# EAGLE design CD Memory New (EAGLE 7.7.0)
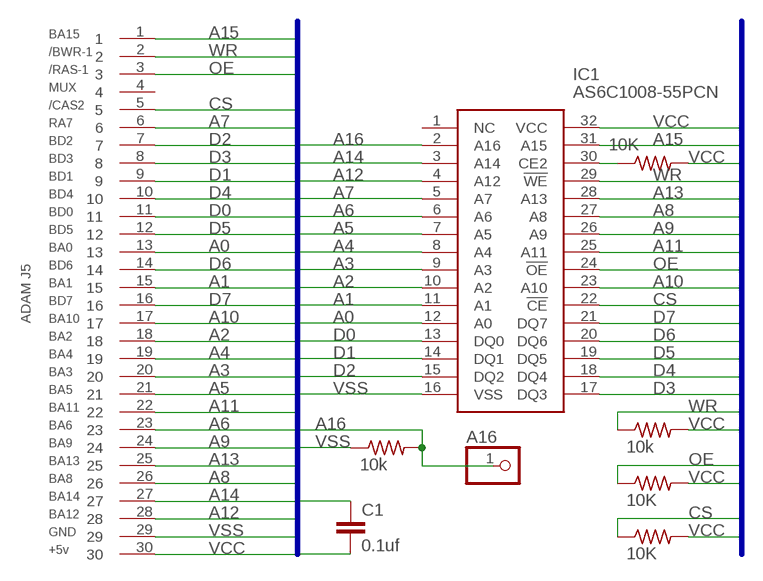
[diagram p0: schematic, sheet 1]

## Parts
A16  PINHD-1X1  [1X01]
C1  0.1uf  C-EU050-030X075  [C050-030X075]
IC1  AS6C1008-55PCN  [DIP254P1524X393-32]
R1  10K  R-US_V526-0  [V526-0]
R2  10k  R-US_V526-0  [V526-0]
R3  10K  R-US_V526-0  [V526-0]
R4  10K  R-US_V526-0  [V526-0]
R5  10k  R-US_V526-0  [V526-0]
U$1  MEM_CARD_NO_OUTLINE  [J5CARD_NO_OUTLINE]

## Nets
A0: IC1.12(A0) U$1.13
A1: IC1.11(A1) U$1.15
A2: IC1.10(A2) U$1.18
A3: IC1.9(A3) U$1.20
A4: IC1.8(A4) U$1.19
A5: IC1.7(A5) U$1.21
A6: IC1.6(A6) U$1.23
A7: IC1.5(A7) U$1.6
A8: IC1.27(A8) U$1.26
A9: IC1.26(A9) U$1.24
A10: IC1.23(A10) U$1.17
A11: IC1.25(A11) U$1.22
A12: IC1.4(A12) U$1.28
A13: IC1.28(A13) U$1.25
A14: IC1.3(A14) U$1.27
A15: IC1.31(A15) U$1.1
A16: A16.1 IC1.2(A16) R5.2
CS: IC1.22(!CE) R4.1 U$1.5
D0: IC1.13(DQ0) U$1.11
D1: IC1.14(DQ1) U$1.9
D2: IC1.15(DQ2) U$1.7
D3: IC1.17(DQ3) U$1.8
D4: IC1.18(DQ4) U$1.10
D5: IC1.19(DQ5) U$1.12
D6: IC1.20(DQ6) U$1.14
D7: IC1.21(DQ7) U$1.16
N$1: IC1.30(CE2) R1.1
OE: IC1.24(!OE) R3.1 U$1.3
VCC: C1.2 IC1.32(VCC) R1.2 R2.2 R3.2 R4.2 U$1.30
VSS: C1.1 IC1.16(VSS) R5.1 U$1.29
WR: IC1.29(!WE) R2.1 U$1.2
Unconnected: IC1.1(NC) U$1.4

## Buses
VSS,VCC,A[0..16],D[0..7],CS,OE,WR

## Library data of the parts
A16 = pinhead:PINHD-1X1: PIN HEADER
C1 = rcl:C-EU: CAPACITOR, European symbol
IC1 = SamacSys_Parts:AS6C1008-55PCN: CMOS SRAM Source: Datasheet <http://componentsearchengine.com/Datasheets/1/AS6C1008-55PCN.pdf>; DESCRIPTION: CMOS SRAM; HEIGHT: mm; MANUFACTURER_NAME: Alliance Memory; MANUFACTURER_PART_NUMBER: AS6C1008-55PCN; MOUSER_PART_NUMBER: 913-AS6C1008-55PCN; MOUSER_PRICE-STOCK: https://www.mouser.co.uk/ProductDetail/Alliance-Memory/AS6C1008-55PCN?qs=E5c5%252Bmu3i39qb4Qta5D2qg%3D%3D
R1-R5 = rcl:R-US_: RESISTOR, American symbol
U$1 = ADAM:MEM_CARD_NO_OUTLINE

## Board
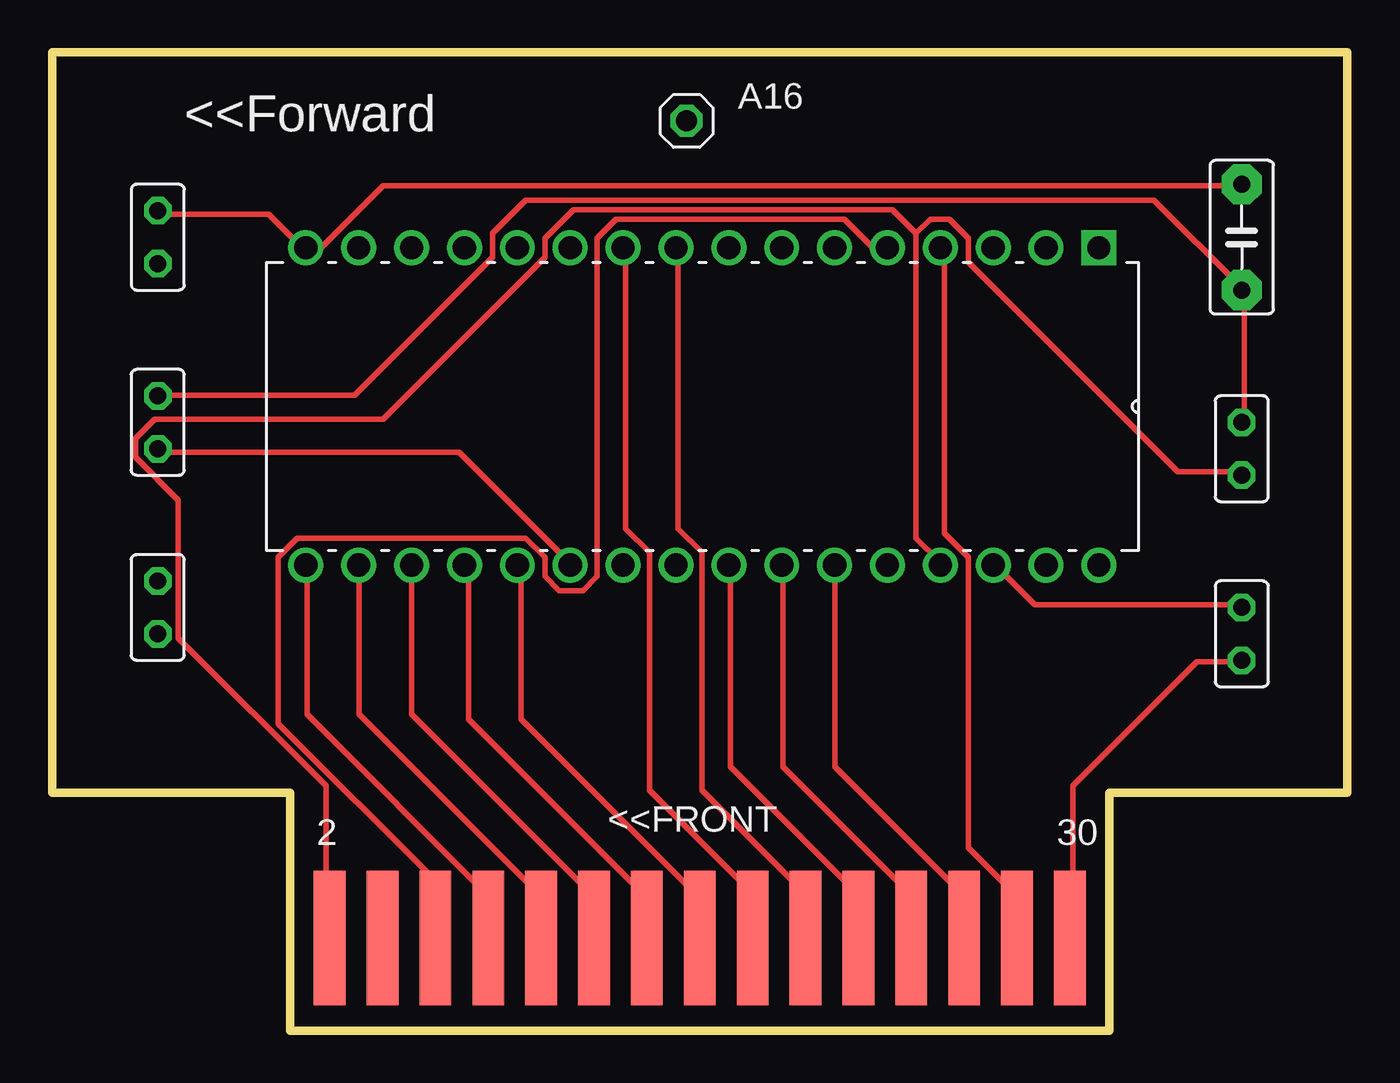
[diagram p1: board, top side]
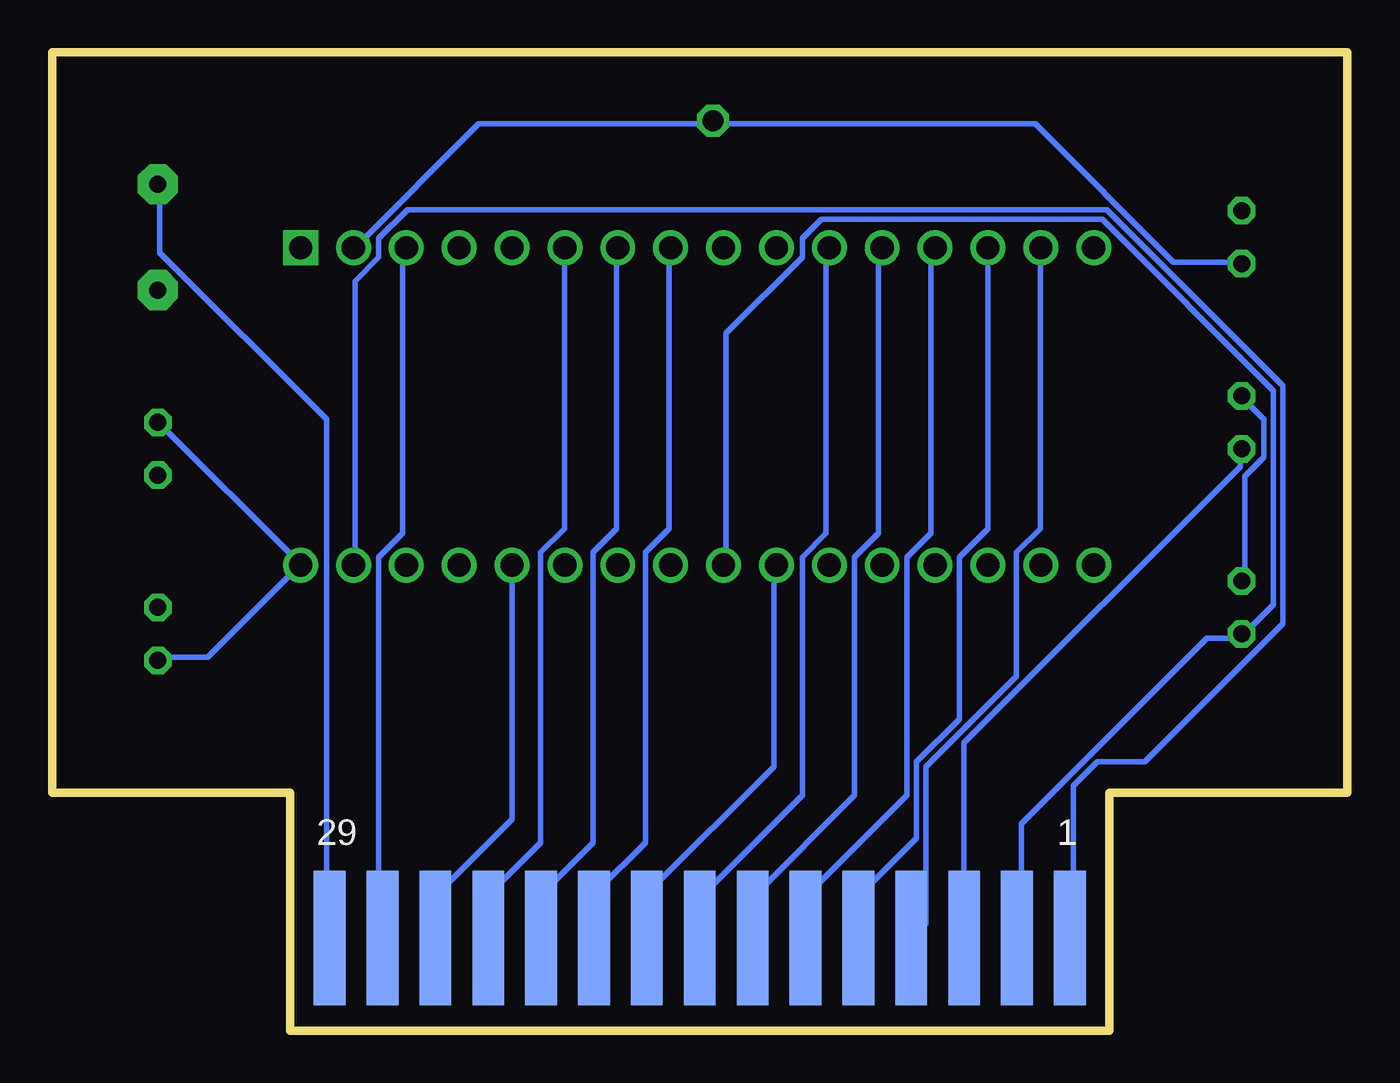
[diagram p2: board, bottom side, seen from below]

Size 62.23 x 46.99 mm. Coordinates in mm from the lower left corner, seen from the top.
Outline: 11.43,11.43 0,11.43 0,46.99 62.23,46.99 62.23,11.43 50.8,11.43 50.8,0 11.43,0 11.43,11.43
Copper layers (1*16): Top 0.035mm / dielectric 1.5mm / Bottom 0.035mm
Design rules "default": minimum track width 10mil, minimum drill 24mil, track to track 8mil, track to pad 8mil, pad to pad 8mil, via to via 8mil, smd to smd 8mil, copper to edge 40mil, drill to drill 8mil, minimum pad ring 10mil, minimum via ring 8mil, stop-mask expansion 4mil, vias tented up to drill 0mil, thermal gap 10mil

### Footprints (pad centres in the part's own frame; a part is rotated, then mirrored left to right if it is on the bottom)
1X01 = drill 1.016 octagon: 1 0,0
C050-030X075 = drill 0.813 pad 1.93 octagon: 1 -2.54,0; 2 2.54,0
DIP254P1524X393-32 = drill 1.118 pad 1.676 square: 1 -15.24,38.1 | drill 1.118 pad 1.676: 2 -15.24,35.56; 3 -15.24,33.02; 4 -15.24,30.48; 5 -15.24,27.94; 6 -15.24,25.4; 7 -15.24,22.86; 8 -15.24,20.32; 9 -15.24,17.78; 10 -15.24,15.24; 11 -15.24,12.7; 12 -15.24,10.16; 13 -15.24,7.62; 14 -15.24,5.08; 15 -15.24,2.54; 16 -15.24,0; 17 0,0; 18 0,2.54; 19 0,5.08; 20 0,7.62; 21 0,10.16; 22 0,12.7; 23 0,15.24; 24 0,17.78; 25 0,20.32; 26 0,22.86; 27 0,25.4; 28 0,27.94; 29 0,30.48; 30 0,33.02; 31 0,35.56; 32 0,38.1
V526-0 = drill 0.813 octagon: 1 -1.27,0; 2 1.27,0
J5CARD_NO_OUTLINE = smd 1.524 x 6.477 bottom: 1 -18.415,-5.715; 3 -15.875,-5.715; 5 -13.335,-5.715; 7 -10.795,-5.715; 9 -8.255,-5.715; 11 -5.715,-5.715; 13 -3.175,-5.715; 15 -0.635,-5.715; 17 1.905,-5.715; 19 4.445,-5.715; 21 6.985,-5.715; 23 9.525,-5.715; 25 12.065,-5.715; 27 14.605,-5.715; 29 17.145,-5.715 | smd 1.524 x 6.477: 2 -18.415,-5.715; 4 -15.875,-5.715; 6 -13.335,-5.715; 8 -10.795,-5.715; 10 -8.255,-5.715; 12 -5.715,-5.715; 14 -3.175,-5.715; 16 -0.635,-5.715; 18 1.905,-5.715; 20 4.445,-5.715; 22 6.985,-5.715; 24 9.525,-5.715; 26 12.065,-5.715; 28 14.605,-5.715; 30 17.145,-5.715

### Placement (x,y rotation side)
A16  30.48,43.69 0 top
C1  57.15,38.1 270 top
IC1  12.19,22.35 270 top
R1  57.15,19.05 270 top
R2  57.15,27.94 90 top
R3  5.08,20.32 90 top
R4  5.08,29.21 90 top
R5  5.08,38.1 270 top
U$1  31.75,10.16 0 top

### Tracks (layer width: path | path; a pad name or v marks a point on that pad's centre or on a via)
A0
  Bottom 0.254: IC1.12 22.53,37.59 22.53,23.88 23.67,22.73 23.67,11.3 28.47,6.5 28.47,4.45 U$1.13
A1
  Bottom 0.254: IC1.11 25.04,37.59 25.04,23.88 26.19,22.73 26.19,11.3 30.99,6.5 30.99,4.45 U$1.15
A2
  Top 0.254: IC1.10 27.56,37.59 27.56,24.11 28.7,22.96 28.7,11.53 33.5,6.73 33.5,4.45 U$1.18
A3
  Top 0.254: IC1.9 30.07,37.59 30.07,24.11 31.22,22.96 31.22,11.53 36.02,6.73 36.02,4.45 U$1.20
A4
  Bottom 0.254: IC1.8 32.59,37.59 32.59,24.11 33.73,22.96 33.73,9.02 36.02,6.73 36.02,4.45 U$1.19
A5
  Bottom 0.254: IC1.7 35.1,37.59 35.1,24.11 36.25,22.96 36.25,9.02 38.53,6.73 38.53,4.45 U$1.21
A6
  Bottom 0.254: U$1.23 41.28,6.5 38.76,9.02 38.76,22.96 37.62,24.11 37.62,37.59 IC1.6
A7
  Top 0.254: IC1.5 39.45,37.59 38.08,38.96 27.1,38.96 26.19,38.05 26.19,21.82 25.5,21.13 24.36,21.13 23.67,21.82 23.67,22.73 22.76,23.65 11.79,23.65 10.87,22.73 10.87,14.73 18.41,7.19 U$1.6
A8
  Top 0.254: IC1.27 37.62,22.28 37.62,12.68 43.79,6.5 43.79,4.45 U$1.26
A9
  Top 0.254: U$1.24 41.28,6.5 35.1,12.68 35.1,22.28 IC1.26
A10
  Bottom 0.254: IC1.23 27.56,22.28 27.56,12.68 33.5,6.73 33.5,4.45 U$1.17
A11
  Top 0.254: IC1.25 32.59,22.28 32.59,12.68 38.53,6.73 38.53,4.45 U$1.22
A12
  Top 0.254: IC1.4 42.88,37.59 42.88,23.88 44.02,22.73 44.02,8.79 46.3,6.5 46.3,4.45 U$1.28
A13
  Bottom 0.254: IC1.28 40.13,10.16 43.79,6.5 43.79,4.45 U$1.25
A14
  Bottom 0.254: IC1.3 45.39,37.59 45.39,23.88 46.53,22.73 46.53,4.45 U$1.27
A15
  Bottom 0.254: IC1.31 47.68,22.5 47.68,35.99 46.53,37.13 46.53,38.05 45.16,39.42 11.56,39.42 3.1,30.96 3.1,19.53 9.73,12.9 12.01,12.9 13.16,11.76 13.16,4.45 U$1.1
A16
  Bottom 0.254: R5.2 5.16,36.91 8.36,36.91 14.99,43.54 30.3,43.54 A16.1 30.53,43.54 41.73,43.54 47.68,37.59 IC1.2
CS
  Top 0.254: R4.1 5.16,27.76 19.56,27.76 24.82,22.5 IC1.22
  Bottom 0.254: U$1.5 18.41,13.82 5.16,27.08 5.16,27.76 R4.1
D0
  Bottom 0.254: IC1.13 20.02,37.59 20.02,23.88 21.16,22.73 21.16,11.3 25.96,6.5 25.96,4.45 U$1.11
D1
  Bottom 0.254: IC1.14 17.27,24.11 18.64,22.73 18.64,14.96 20.7,12.9 20.7,9.25 23.44,6.5 23.44,4.45 U$1.9
D2
  Bottom 0.254: IC1.15 14.76,37.59 14.76,24.11 15.9,22.96 15.9,17.02 20.24,12.68 20.24,5.13 20.93,4.45 U$1.7
D3
  Top 0.254: IC1.17 12.24,22.28 12.24,15.19 20.93,6.5 20.93,4.45 U$1.8
D4
  Top 0.254: IC1.18 14.76,22.28 14.76,15.19 23.44,6.5 23.44,4.45 U$1.10
D5
  Top 0.254: IC1.19 17.27,15.19 25.96,6.5 25.96,4.45 U$1.12
D6
  Top 0.254: IC1.20 20.02,22.28 20.02,14.96 28.47,6.5 28.47,4.45 U$1.14
D7
  Top 0.254: IC1.21 22.53,22.28 22.53,14.96 30.99,6.5 30.99,4.45 U$1.16
N$1
  Top 0.254: R1.1 57.05,20.45 47.22,20.45 45.39,22.28 IC1.30
OE
  Bottom 0.254: U$1.3 15.67,4.45 15.67,9.93 6.76,18.85 5.16,18.85 R3.1 4.93,19.07 3.56,20.45 3.56,30.73 11.79,38.96 25.27,38.96 26.19,38.05 26.19,37.13 29.84,33.48 29.84,22.5 IC1.24
VCC
  Top 0.254: U$1.30 49.05,4.45 49.05,11.76 54.99,17.7 57.05,17.7 R1.2 | R2.2 57.28,29.36 57.28,35.53 C1.2 57.05,35.76 52.93,39.88 22.76,39.88 21.16,38.28 21.16,37.13 14.53,30.5 5.16,30.5 R4.2
  Bottom 0.254: R1.2 57.05,17.93 54.76,17.93 50.42,22.28 IC1.32 50.42,22.5 57.05,29.13 R2.2 | R3.2 4.93,21.59 4.93,26.62 4.01,27.53 4.01,29.36 4.93,30.28 R4.2
VSS
  Top 0.254: R5.1 5.16,39.19 10.41,39.19 12.01,37.59 IC1.16 12.93,37.59 15.9,40.56 57.05,40.56 C1.1
  Bottom 0.254: C1.1 57.05,40.56 57.05,37.36 49.05,29.36 49.05,4.45 U$1.29
WR
  Top 0.254: 41.5,38.28 42.19,38.96 43.1,38.96 44.02,38.05 44.02,36.91 54.08,26.85 57.05,26.85 R2.1 | 41.5,38.28 41.5,23.65 42.65,22.5 IC1.29 | 41.5,38.28 40.36,39.42 25.04,39.42 23.67,38.05 23.67,37.13 15.9,29.36 4.93,29.36 4.01,28.45 4.01,27.53 6.07,25.48 6.07,18.85 13.16,11.76 13.16,4.45 U$1.2

### Text on the board
tNames: <<Forward